# EasyEDA Pro project pcbsrc.eprj

# Schematic Schematic1

## Sheets
1 esp32: Board Name: Board1; Create Date: 2025-06-22; Page Name: P1; Project Name: pcbsrc; Schematic Name: Schematic1; Update Date: 2025-06-22; Company: 嘉立创EDA; Page Size: A4; Version: V1.0
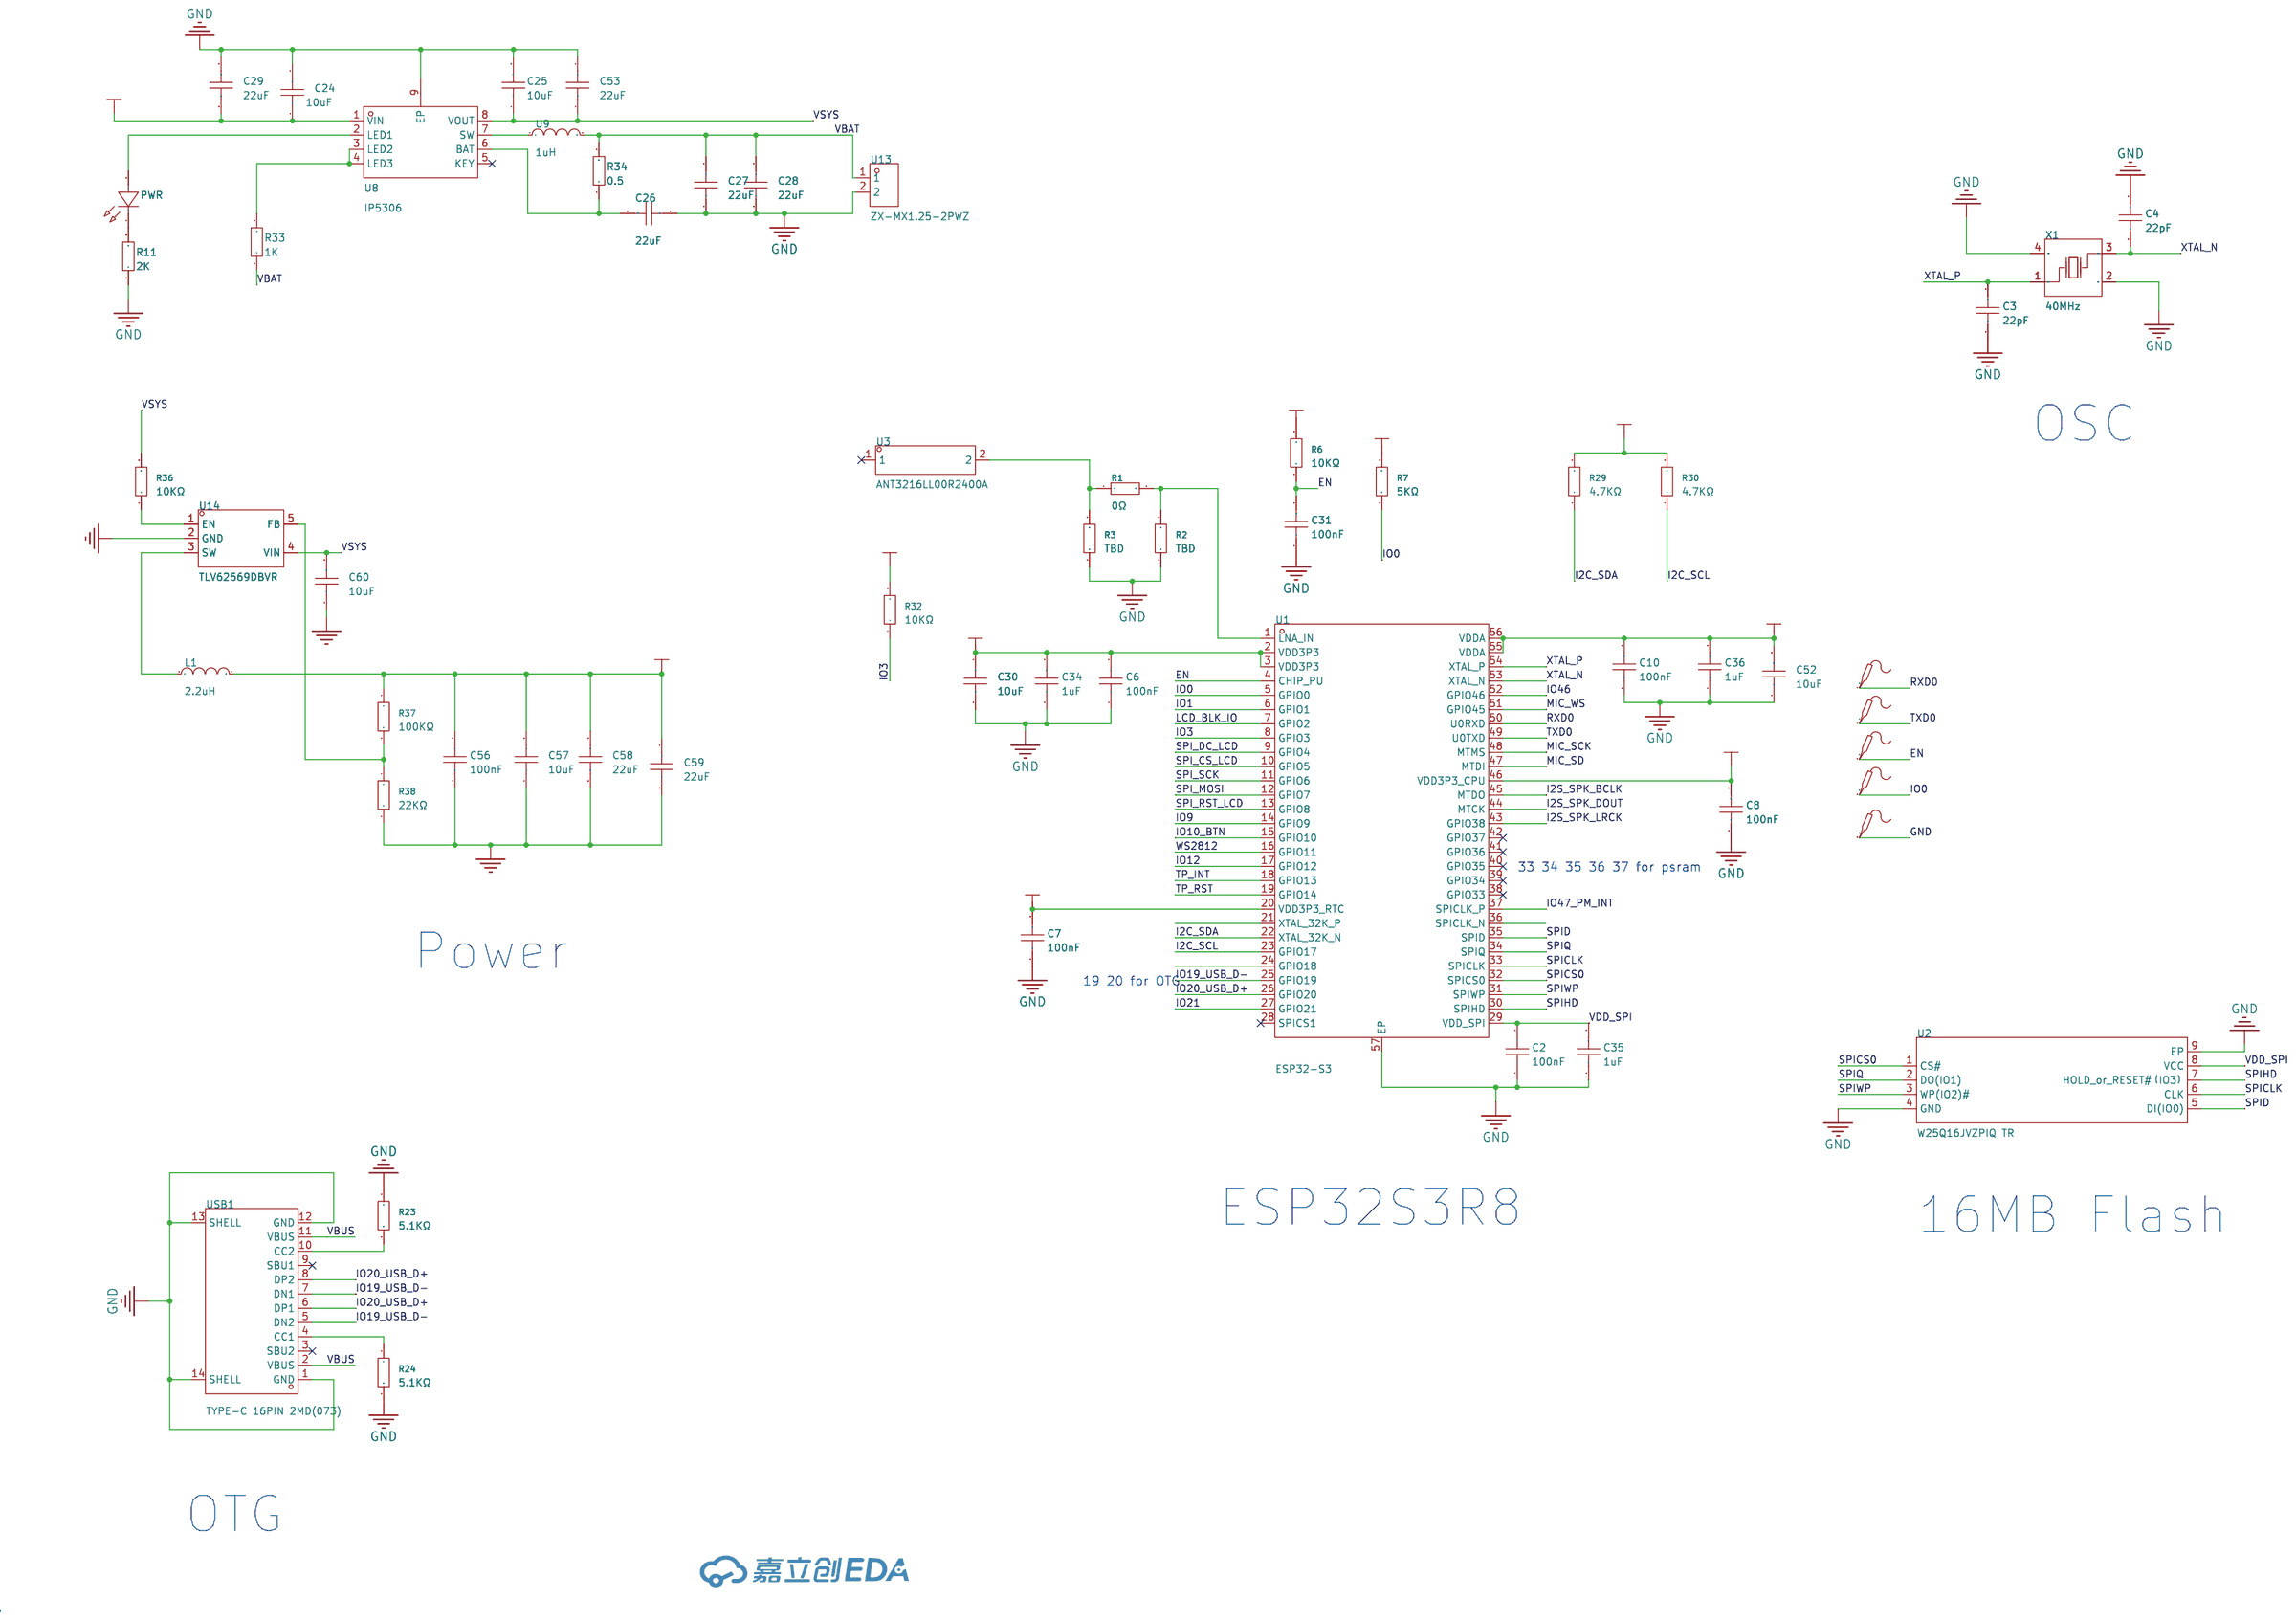
[diagram p0: esp32]
2 peripheral: Page Name: P2
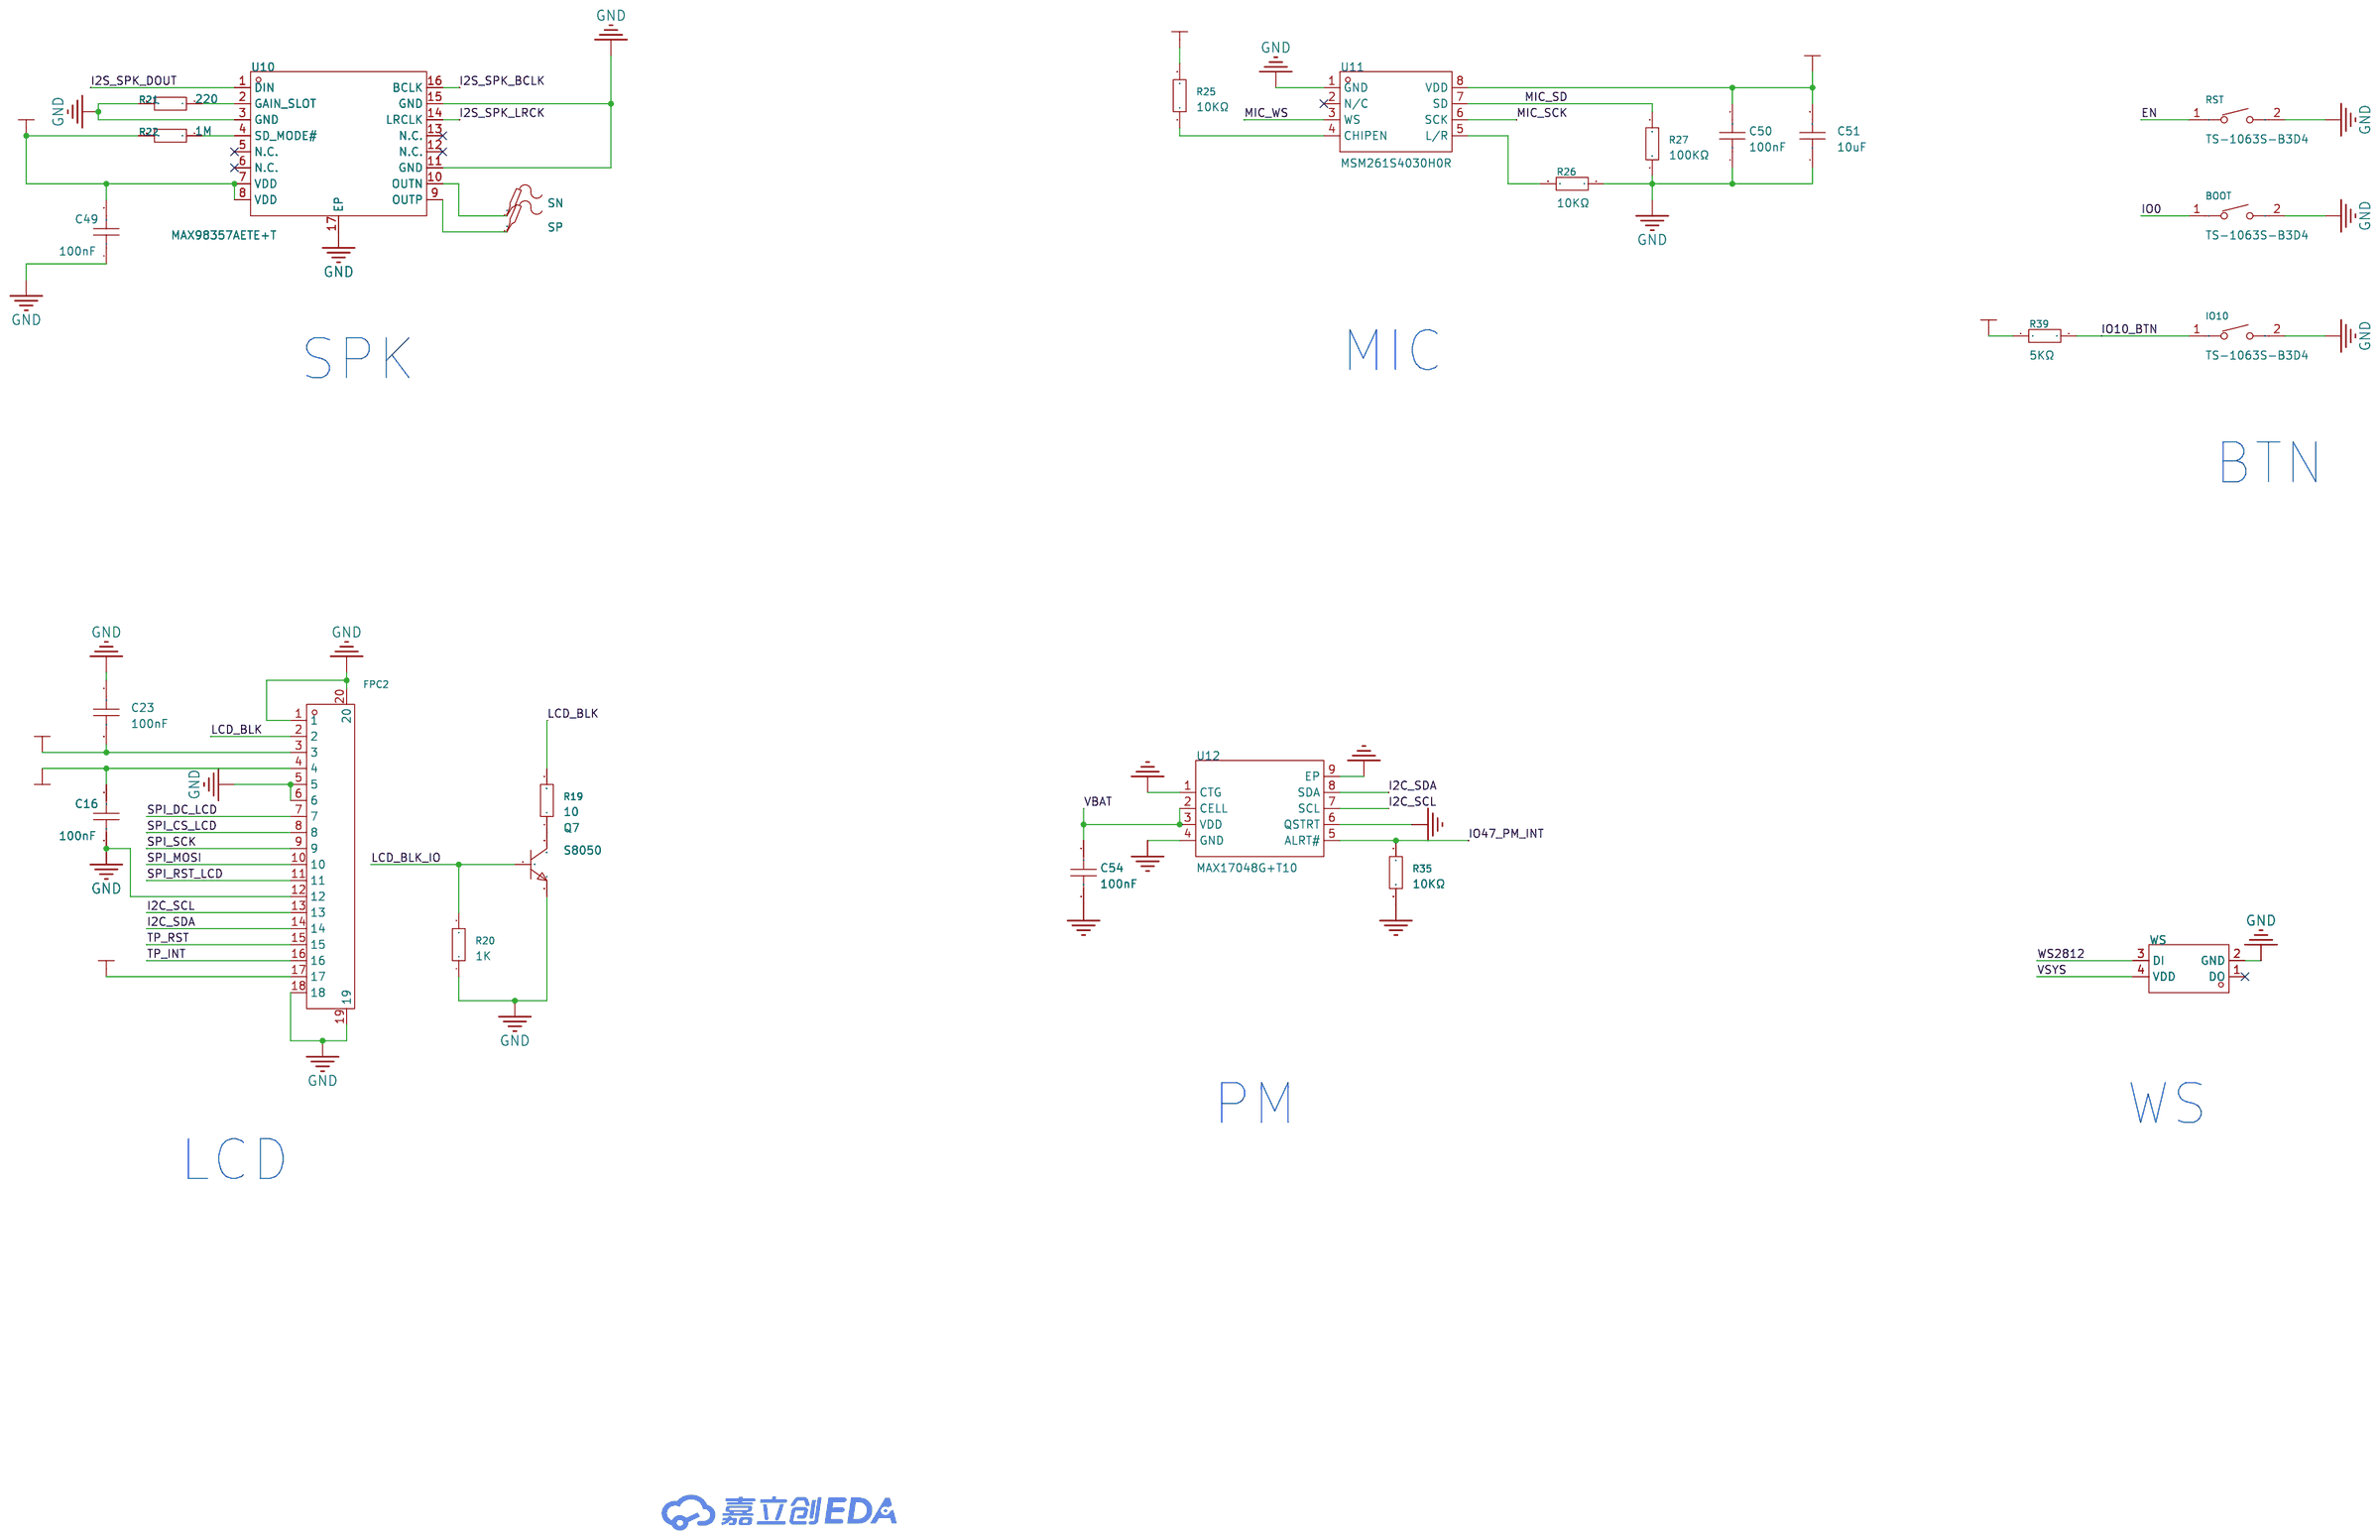
[diagram p1: peripheral]

## Parts
sheet esp32
C2  100nF  [C0402]
C3  22pF  [C0402]
C4  22pF  [C0402]
C6  100nF  [C0402]
C7  100nF  [C0402]
C8  100nF  [C0402]
C10  100nF  [C0402]
C24  10uF  [C0603]
C25  10uF  [C0603]
C26  22uF  [C0603]
C27  22uF  [C0603]
C28  22uF  [C0603]
C29  22uF  [C0603]
C30  10uF  [C0603]
C31  100nF  [C0402]
C34  1uF  [C0402]
C35  1uF  [C0402]
C36  1uF  [C0402]
C52  10uF  [C0603]
C53  22uF  [C0603]
C56  100nF  [C0402]
C57  10uF  [C0603]
C58  22uF  [C0603]
C59  22uF  [C0603]
C60  10uF  [C0603]
EN  -  [Test-Point-0.5mm]
IO0  -  [Test-Point-0.5mm]
IO11  -  [Test-Point-0.5mm]
L1  2.2uH  [IND-SMD_L4.0-W4.0_LQH44PN2R2MP0L]
PWR  XL-1608SURC-06  [LED0603-RD_RED]
R1  0Ω  [R0402]
R2  TBD  [R0402]
R3  TBD  [R0402]
R6  10KΩ  [R0402]
R7  5KΩ  [R0402]
R11  2K  [R0402]
R23  5.1KΩ  [R0402]
R24  5.1KΩ  [R0402]
R29  4.7KΩ  [R0402]
R30  4.7KΩ  [R0402]
R32  10KΩ  [R0402]
R33  1K  [R0402]
R34  1K  [R0402]
R36  10KΩ  [R0402]
R37  100KΩ  [R0402]
R38  22KΩ  [R0402]
RXD0  -  [Test-Point-0.5mm]
TXD0  -  [Test-Point-0.5mm]
U1  ESP32-S3  [QFN-56_L7.0-W7.0-P0.40-TL-EP4.0]
U2  W25Q16JVZPIQ TR  [WSON-8_L6.0-W5.0-P1.27-BL-EP]
U3  ANT3216LL00R2400A  [ANT-SMD_L3.2-W1.6]
U8  IP5306  [ESOP-8_L4.9-W3.9-P1.27-LS6.0-BL-EP]
U9  1uH  [IND-SMD_L2.5-W2.0_YXNAQ252010-3R3M]
U13  ZX-MX1.25-2PWZ  [CONN-TH_2P-P1.25_ZX-MX1.25-2PWZ]
U14  TLV62569DBVR  [SOT-23-5_L3.0-W1.7-P0.95-LS2.8-BR]
USB1  TYPE-C 16PIN 2MD(073)  [USB-C-SMD_TYPE-C-6PIN-2MD-073]
X1  40MHz  [OSC-SMD_4P-L3.2-W2.5-BL_SIT8008BI]
sheet peripheral
BOOT  TS-1063S-B3D4  [KEY-SMD_L3.0-W2.5-LS4.0_TS-1603S]
C16  100nF  [C0402]
C23  100nF  [C0402]
C49  100nF  [C0402]
C50  100nF  [C0402]
C51  10uF  [C0603]
C54  100nF  [C0402]
FPC2  FPC-05F-18PH20  [FPC-SMD_18P-P0.50_FPC-05F-18PH20]
IO10  TS-1063S-B3D4  [KEY-SMD_L3.0-W2.5-LS4.0_TS-1603S]
Q7  S8050  [SOT-23-3_L2.9-W1.3-P1.90-LS2.3-BR]
R19  10  [R0402]
R20  1K  [R0402]
R21  220  [R0402]
R22  1M  [R0402]
R25  10KΩ  [R0402]
R26  10KΩ  [R0402]
R27  100KΩ  [R0402]
R35  10KΩ  [R0402]
R39  5KΩ  [R0402]
RST  TS-1063S-B3D4  [KEY-SMD_L3.0-W2.5-LS4.0_TS-1603S]
SN  -  [Test-Point-0.5mm]
SP  -  [Test-Point-0.5mm]
U10  MAX98357AETE+T  [TQFN-16_L3.0-W3.0-P0.50-BL-EP1.5]
U11  MSM261S4030H0R  [MIC-SMD_8P-L4.0-W3.0-P1.00-BR]
U12  MAX17048G+T10  [TDFN-8_L2.0-W2.0-P0.50-BL-EP1.2]
WS  XL-2020RGBC-WS2812B  [LED-SMD_4P-L2.0-W2.0-BR-1]

## Library data of the parts
C2-C4 C6-C8 C10 C31 C34-C36 C50 C54 C56 = CL05A105KA5NQNC: Capacitance: Tolerance:±10% Tolerance:±10% Voltage Rated: Temperature Coefficient:; LCSC Part Name: 1uF ±10% 25V; Supplier Part: C52923; Manufacturer: SAMSUNG(三星); Supplier Footprint: 0402; JLCPCB Part Class: Basic Part; Datasheet: https://atta.szlcsc.com/upload/public/pdf/source/20160218/1457707763339.pdf; Supplier: LCSC; Tolerance: ±10%
C24-C29 C53 C58 C59 = CGA0603X5R106K100JT: 容值:10uF;精度:±10%;额定电压:10V;材质(温度系数):X5R;; LCSC Part Name: 10uF ±10% 10V; Supplier Part: C6119842; Manufacturer: HRE(芯声); Supplier Footprint: 0603; JLCPCB Part Class: 扩展库; Supplier: LCSC; Tolerance: ±10%; Voltage Rated: 10V; Temperature Coefficient: X5R
C30 C51 C52 C57 C60 = CGA0603X5R106K100JT: Capacitance:10uF Tolerance:±10% Tolerance:±10% Voltage Rating:10V Temperature Coefficient:X5R; LCSC Part Name: 10uF ±10% 10V; Supplier Part: C6119842; Manufacturer: HRE(芯声); Supplier Footprint: 0603; JLCPCB Part Class: Extended Part; Supplier: LCSC; Tolerance: ±10%; Voltage Rating: 10V; Temperature Coefficient: X5R
EN IO0 IO11 RXD0 TXD0 = Test-Point
L1 = SMNR4020-2.2UH: LCSC Part Name: 2.2uH ±20% 3.4A; Supplier Part: C135262; Manufacturer: SXN(顺翔诺); Supplier Footprint: SMD,4x4x2mm; Datasheet: https://atta.szlcsc.com/upload/public/pdf/source/20210812/995F2AD58C1C491532425584E325E086.pdf; Supplier: LCSC; Tolerance: ±20%; Rated Current: 3.4A; Saturation Current (Isat): 3.4A; DC Resistance (DCR): 46mΩ
PWR = XL-1608SURC-06: 发光颜色:红色;功率:55mW;正向电流:25mA;主波长:617nm~621nm;透镜颜色:无色透明透镜;色温:-;发光角度:120°;载带方式:正贴;工作温度:-30℃~+85℃;; Supplier Part: C965799; Manufacturer: XINGLIGHT(成兴光); Supplier Footprint: 0603; JLCPCB Part Class: 扩展库; Datasheet: https://atta.szlcsc.com/upload/public/pdf/source/20221102/D860AFDD1CDB02C5A8064103A32707E2.pdf; Supplier: LCSC; Emitted Color: 红色; Power Dissipation: 55mW; Forward Current: 25mA; Dominant Wavelength: 617nm~621nm; Peak Wavelength: 623nm; Lens Color: 无色透明透镜; Viewing Angle: 120°; Mounting Sytle: 正贴; Operating Temperature: -30℃~+85℃
R1-R3 R6 R7 R23-R27 R29 R30 R32 R35-R39 = 0402WGF0000TCE: Type:Thick Film Resistors Resistance: Tolerance:±1% Tolerance:±1% Power(Watts): Overload Voltage (Max): Temperature Coefficient:±800ppm/℃ Temperature Coefficient:±800ppm/℃ Operating Temperature Range:-55℃~+155℃ Operating Temperature Range:-55℃~+155℃; LCSC Part Name: 0Ω ±1% 62.5mW 厚膜电阻; Supplier Part: C17168; Manufacturer: UNI-ROYAL(厚声); Supplier Footprint: 0402; JLCPCB Part Class: Basic Part; Datasheet: https://atta.szlcsc.com/upload/public/pdf/source/20200306/C422600_1E6D84923E4A46A82E41ADD87F860B5C.pdf; Supplier: LCSC; Type: Thick Film Resistors; Tolerance: ±1%; Temperature Coefficient: ±800ppm/℃; Operating Temperature Range: -55℃~+155℃
R11 R33 R34 = 0402WGF4700TCE: 电阻类型:厚膜电阻;阻值:470Ω;精度:±1%;功率:62.5mW;最大工作电压:50V;温度系数:±100ppm/℃;; LCSC Part Name: 470Ω ±1% 62.5mW 厚膜电阻; Supplier Part: C25117; Manufacturer: UNI-ROYAL(厚声); Supplier Footprint: 0402; JLCPCB Part Class: 基础库; Datasheet: https://atta.szlcsc.com/upload/public/pdf/source/20200306/C422600_1E6D84923E4A46A82E41ADD87F860B5C.pdf; Supplier: LCSC; Type: 厚膜电阻; Tolerance: ±1%; Power(Watts): 62.5mW; Overload Voltage (Max): 50V; Temperature Coefficient: ±100ppm/℃; Operating Temperature Range: -55℃~+155℃
U1 = ESP32-S3: Frequency Range:2412MHz~2484MHz Frequency Range:2412MHz~2484MHz Interface:ADC,GPIO,I2C,I2S,PWM,SPI,UART,USB Operating Voltage:3V~3.6V Operating Voltage:3V~3.6V Applications:WiFi；IoT Output Power:21dBm Data Rate:150Mbps Current Of Transmitting:340mA Sensit; LCSC Part Name: 支持2.4GHz WIFI和低功耗蓝牙的MCU SoC; Supplier Part: C2913192; Manufacturer: ESPRESSIF(乐鑫); Supplier Footprint: QFN-56-EP(7x7); JLCPCB Part Class: Extended Part; Datasheet: https://atta.szlcsc.com/upload/public/pdf/source/20241030/3428D9BCA56E860957850BFAF37EAC62.pdf; Supplier: LCSC; Frequency Range: 2412MHz~2484MHz; Interface: ADC,GPIO,I2C,I2S,PWM,SPI,UART,USB; Operating Voltage: 3V~3.6V; Applications: WiFi；IoT; Output Power: 21dBm; Data Rate: 150Mbps; Current Of Transmitting: 340mA; Sensitivity: -98.4dBm; Receive Current: 88mA; Typical Application Frequency: 2.4GHz; Operating Temperature: -40℃~+105℃
U2 = W25Q16JVZPIQ TR: Supplier Part: C2456208; Manufacturer: WINBOND(华邦); Supplier Footprint: WSON-8-EP(5x6); JLCPCB Part Class: Extended Part; Datasheet: https://atta.szlcsc.com/upload/public/pdf/source/20190529/C115407_78E5B4F96E7138D299EC51EC5982A1A5.pdf; Supplier: LCSC
U3 = ANT3216LL00R2400A: Antenna Type:Chip Antenna Central Frequency:2450MHz Bandwidth:160MHz Peak Gain:5.05dBi Peak Gain:5.05dBi Polarization Type:Linear Impedance:50Ω Power capacity:1W VSWR:- Operating Temperature:-40℃~+105℃ Operating Temperature:-40℃~+105℃; LCSC Part Name: 无线组件陶瓷芯片天线; Supplier Part: C293767; Manufacturer: YAGEO(国巨); Supplier Footprint: 1206; JLCPCB Part Class: Extended Part; Datasheet: https://atta.szlcsc.com/upload/public/pdf/source/20181012/C293767_CDE82A2F74DC82A94DB708CB53B68F23.pdf; Supplier: LCSC; Antenna Type: Chip Antenna; Central Frequency: 2450MHz; Bandwidth: 160MHz; Peak Gain: 5.05dBi; Polarization Type: Linear; Impedance: 50Ω; Power capacity: 1W; Operating Temperature: -40℃~+105℃
U8 = IP5306: Supplier Part: C181692; Manufacturer: INJOINIC(英集芯); Supplier Footprint: ESOP-8; JLCPCB Part Class: Extended Part; Datasheet: https://atta.szlcsc.com/upload/public/pdf/source/20190627/C384572_9925B3DDC4041BC6108E5AB46A2A0AB1.pdf; Supplier: LCSC
U9 = IND\L2.5XW: Supplier Part: C9900016568; Supplier Footprint: 2.2uH/60; JLCPCB Part Class: Extended Part; Supplier: LCSC
U13 = ZX-MX1.25-2PWZ: Pins Structure:1x2P Pitch:1.25mm Mounting Style:Bend-in Reference Series:PicoBlade(MX 1.25) Number of Pins:2P Number of Rows:1 Number of PINs Per Row:2 Row Spacing:- Current Rating (Max):- Contact Material:Brass Contact Plating:Tin Operating Temperature R; LCSC Part Name: 1x2P 间距:1.25mm 弯插 系列:PicoBlade(MX 1.25) 配套胶壳型号：ZX-MX1.25-2PJK 配套端子型号：ZX-MX1.25-DZ 配套杜邦线型号：ZX-MX1.25-2PBXC; Supplier Part: C7430463; Manufacturer: Megastar(兆星); Supplier Footprint: 弯插,P=1.25mm; JLCPCB Part Class: Extended Part; Datasheet: https://atta.szlcsc.com/upload/public/pdf/source/20230619/EFC7482EB916E36F9EF0B03A9637C24F.pdf; Supplier: LCSC; Pins Structure: 1x2P; Pitch: 1.25mm; Mounting Style: Bend-in; Reference Series: PicoBlade(MX 1.25); Number of Pins: 2P; Number of Rows: 1; Number of PINs Per Row: 2; Contact Material: Brass; Contact Plating: Tin; Colour: White; Z-Height of the Board: 3.3mm; X-Length of Bottom Edge on Board (Spacing Line): 4.4mm; Y-Width of Bottom Edge on Board: 4.6mm
U14 = TLV62569DBVR: LCSC Part Name: 高效率同步降压转换器; Supplier Part: C141836; Manufacturer: TI(德州仪器); Supplier Footprint: SOT-23-5; Datasheet: https://www.ti.com/cn/lit/gpn/tlv62569; Supplier: LCSC; Function: 降压型; Output Type: 可调; Voltage - Supply: 2.5V~5.5V; Output Voltage: 600mV~5.5V; Output Current: 2A; Frequency - Switching: 1.5MHz; Operating Temperature: -40℃~+125℃@(TJ); Synchronous Rectifier: 是; Number of Outputs: 1; Topology: 降压式; Switch tube (built-in/external): 内置
USB1 = TYPE-C 16PIN 2MD(073): Connector Type:Type-C Standard:USB 3.1 Gender:Female Mounting Style:Horizontal attachment Number of Contacts:16P Number of Ports:1 Current Rating - Power (Max):5A Operating Temperature Range:-25℃~+85℃ Operating Temperature Range:-25℃~+85℃ Rated Voltage (M; LCSC Part Name: Type-C 母 卧贴; Supplier Part: C2765186; Manufacturer: SHOU HAN(首韩); Supplier Footprint: SMD; JLCPCB Part Class: Extended Part; Datasheet: https://atta.szlcsc.com/upload/public/pdf/source/20211123/39B17C16241EAC15C5E277BDA434118E.pdf; Supplier: LCSC; Connector Type: Type-C; Standard: USB 3.1; Gender: Female; Mounting Style: Horizontal attachment; Number of Contacts: 16P; Number of Ports: 1; Current Rating - Power (Max): 5A; Operating Temperature Range: -25℃~+85℃; Rated Voltage (Max): 5V; Connect-Disconnect Life: 5000 Cuts; Core Colour: Black
X1 = X322540MPB4SI: Crystal Type:Surface Mount Crystal Frequency: Normal temperature Frequency Tolerance:±10ppm Normal temperature Frequency Tolerance:±10ppm External load capacitor: Frequency Stability(Full temperature range):±20ppm Frequency Stability(Full temperature rang; LCSC Part Name: 40MHz ±10ppm 15pF; Supplier Part: C9010; Manufacturer: YXC(扬兴晶振); Supplier Footprint: SMD3225-4P; JLCPCB Part Class: Extended Part; Datasheet: https://atta.szlcsc.com/upload/public/pdf/source/20240329/19D5F850207469550BEB00D7DFEDBC7A.pdf; Supplier: LCSC; Crystal Type: Surface Mount Crystal; Normal temperature Frequency Tolerance: ±10ppm; Frequency Stability(Full temperature range): ±20ppm
BOOT IO10 RST = TS-1063S-B3D4: Circuit:SPST Actuator Style:Rectangle button Operating Force:250gf Mounting Style:- With Lamp:- Mechanical Life:-; LCSC Part Name: 轻触开关3.0*2.5侧按贴片带柱小小龟250gf; Supplier Part: C498291; Manufacturer: Yuandi(元迪); JLCPCB Part Class: Extended Part; Datasheet: https://atta.szlcsc.com/upload/public/pdf/source/20200318/C498291_A3607BD92317BA61A63F6AFAF35A0DD0.pdf; Supplier: LCSC; Circuit: SPST; Actuator Style: Rectangle button; Operating Force: 250gf
C16 C23 C49 = CL05B104KO5NNNC: Capacitance: Tolerance:±10% Tolerance:±10% Voltage Rated: Temperature Coefficient:; LCSC Part Name: 100nF ±10% 16V; Supplier Part: C1525; Manufacturer: SAMSUNG(三星); Supplier Footprint: 0402; JLCPCB Part Class: Basic Part; Datasheet: https://atta.szlcsc.com/upload/public/pdf/source/20160218/1457707763339.pdf; Supplier: LCSC; Tolerance: ±10%
FPC2 = FPC-05F-18PH20: Locking Feature:Clamshell Contact Type:Bottom Contact Number of Contacts:18P Pitch:0.5mm Mounting Type:卧贴 FFC, FCB Thickness:0.3mm FFC, FCB Thickness:0.3mm Height Above Board:2mm Operating Temperature Range:-25℃~+85℃ Operating Temperature Range:-25℃~+85℃; LCSC Part Name: 间距:0.5mm P数:18P 翻盖式 下接; Supplier Part: C2856802; Manufacturer: XUNPU(讯普); Supplier Footprint: SMD,P=0.5mm,卧贴; JLCPCB Part Class: Extended Part; Datasheet: https://atta.szlcsc.com/upload/public/pdf/source/20210922/C2856802_2A845D1961F33AEC1ED22CECB292335F.pdf; Supplier: LCSC; Locking Feature: Clamshell; Contact Type: Bottom Contact; Number of Contacts: 18P; Pitch: 0.5mm; Mounting Type: 卧贴; FFC, FCB Thickness: 0.3mm; Height Above Board: 2mm; Operating Temperature Range: -25℃~+85℃
Q7 = S8050_C20069125: type:NPN Current - Collector(Ic): Collector - Emitter Voltage VCEO: Pd - Power Dissipation:300mW DC Current Gain:120@50mA,1.0V DC Current Gain:120@50mA,1.0V Transition frequency(fT):100MHz Current - Collector Cutoff:100nA Vce Saturation(VCE(sat)):600mV Op; LCSC Part Name: hFE:200-350，丝印:J3Y S8050; Supplier Part: C20069125; Manufacturer: 宏嘉诚; Supplier Footprint: SOT-23; JLCPCB Part Class: Extended Part; Datasheet: https://atta.szlcsc.com/upload/public/pdf/source/20250107/343E8B94B5C24D0D65D7D4B70E0B73F6.pdf; Supplier: LCSC; type: NPN; Pd - Power Dissipation: 300mW; DC Current Gain: 120@50mA,1.0V; Transition frequency(fT): 100MHz; Current - Collector Cutoff: 100nA; Vce Saturation(VCE(sat)): 600mV; Operating Temperature: -55℃~+150℃
R19-R22 = 0402WGF4700TCE: Type:Thick Film Resistors Resistance: Tolerance:±1% Tolerance:±1% Power(Watts): Overload Voltage (Max): Temperature Coefficient:±100ppm/℃ Temperature Coefficient:±100ppm/℃ Operating Temperature Range:-55℃~+155℃ Operating Temperature Range:-55℃~+155℃; LCSC Part Name: 470Ω ±1% 62.5mW 厚膜电阻; Supplier Part: C25117; Manufacturer: UNI-ROYAL(厚声); Supplier Footprint: 0402; JLCPCB Part Class: Basic Part; Datasheet: https://atta.szlcsc.com/upload/public/pdf/source/20200306/C422600_1E6D84923E4A46A82E41ADD87F860B5C.pdf; Supplier: LCSC; Type: Thick Film Resistors; Tolerance: ±1%; Temperature Coefficient: ±100ppm/℃; Operating Temperature Range: -55℃~+155℃
SN SP = Test-Point: Test Point 测试点
U10 = MAX98357AETE+T: Type of Power Amplifier: Speaker Channels:Monaural Output Power: Supply Voltage:2.5V~5.5V Supply Voltage:2.5V~5.5V Operating Temperature:-40℃~+85℃ Operating Temperature:-40℃~+85℃; LCSC Part Name: 微型、低成本、PCM 类 D 级放大器具有 AB 级性能; Supplier Part: C910544; Manufacturer: ADI(亚德诺)/MAXIM(美信); Supplier Footprint: TQFN-16-EP(3x3); JLCPCB Part Class: Extended Part; Datasheet: https://atta.szlcsc.com/upload/public/pdf/source/20210106/C910544_CB6DE4B2CEE254A72E6BDB40E718D281.pdf; Supplier: LCSC; Speaker Channels: Monaural; Supply Voltage: 2.5V~5.5V; Operating Temperature: -40℃~+85℃
U11 = MSM261S4030H0R: Supplier Part: C2840615; Manufacturer: MEMS(敏芯微); JLCPCB Part Class: Extended Part; Datasheet: https://atta.szlcsc.com/upload/public/pdf/source/20210707/C2840615_6AE5BCBEE3224C96A8195D5DC270E7C8.pdf; Supplier: LCSC
U12 = MAX17048G+T10: LCSC Part Name: 单节/双节电池电量计使用ModelGauge技术; Supplier Part: C2682616; Manufacturer: ADI(亚德诺)/MAXIM(美信); Supplier Footprint: DFN-8-EP(2x2); Datasheet: https://atta.szlcsc.com/upload/public/pdf/source/20210106/C2682616_818568B5D3BA4B627110FCAA33E0BFB1.pdf; Supplier: LCSC; The Chip Type: 电池监测芯片; Voltage - Supply: 2.5V~4.5V; Type of Battery: 锂离子/聚合物; Number of Cells: 1; Operating Temperature: -40℃~+85℃
WS = XL-2020RGBC-WS2812B: Wavelength:620nm~625nm；470nm~475nm；525nm~530nm Luminous Intensity:150mcd；150mcd；400mcd Lens Color:Translucent Fog Lens Installation method:Positive Stick Operating Temperature:-20℃~+85℃; LCSC Part Name: 幻彩透明; Supplier Part: C5349955; Manufacturer: XINGLIGHT(成兴光); Supplier Footprint: 2020; JLCPCB Part Class: Extended Part; Datasheet: https://atta.szlcsc.com/upload/public/pdf/source/20230111/97A2D5930F183799801175706AF118AF.pdf; Supplier: LCSC; Wavelength: 620nm~625nm；470nm~475nm；525nm~530nm; Luminous Intensity: 150mcd；150mcd；400mcd; Lens Color: Translucent Fog Lens; Installation method: Positive Stick; Operating Temperature: -20℃~+85℃

## Nets
GND: BOOT.2 C2.1 C3.1 C4.2 C6.1 C7.1 C8.1 C10.1 C16.1 C23.1 C24.2 C25.2 C26.1 C27.2 C28.2 C29.1 C30.1 C31.1 C34.1 C35.1 C36.1 C49.1 C50.1 C51.1 C52.1 C53.1 C54.1 C56.1 C57.1 C58.2 C59.2 C60.1 FPC2.1 FPC2.5 FPC2.6 FPC2.12 FPC2.18 FPC2.19 FPC2.20 IO10.2 IO11.1 Q7.2(E) R2.1 R3.1 R11.1 R20.1 R21.2 R23.1 R24.2 R26.1 R27.2 R35.2 R38.2 RST.2 U1.57(EP) U2.4(GND) U2.9(EP) U8.9(EP) U10.3(GND) U10.11(GND) U10.15(GND) U10.17(EP) U11.1(GND) U12.1(CTG) U12.4(GND) U12.6(QSTRT) U12.9(EP) U13.2 U14.2(GND) USB1.1(GND) USB1.12(GND) USB1.13(SHELL) USB1.14(SHELL) WS.2(GND) X1.2(GND) X1.4(GND)
VBAT: C27.1 C28.1 C54.2 R33.1 R34.2 U9.2 U12.2(CELL) U12.3(VDD) U13.1
VBUS: C24.1 C29.2 U8.1(VIN) USB1.2(VBUS) USB1.11(VBUS)
VDD33: C6.2 C7.2 C8.2 C10.2 C16.2 C23.2 C30.2 C34.2 C36.2 C49.2 C50.2 C51.2 C52.2 C56.2 C57.2 C58.1 C59.1 FPC2.3 FPC2.4 FPC2.17 L1.2 R6.2 R7.2 R22.2 R25.2 R29.2 R30.2 R32.2 R37.1 R39.2 U1.2(VDD3P3) U1.3(VDD3P3) U1.20(VDD3P3_RTC) U1.46(VDD3P3_CPU) U1.55(VDDA) U1.56(VDDA) U10.7(VDD) U10.8(VDD) U11.8(VDD)
VDD_SPI: C2.2 C35.2 U1.29(VDD_SPI) U2.8(VCC)
EN: C31.2 EN.1 R6.1 RST.1 U1.4(CHIP_PU)
I2C_SCL: FPC2.13 R30.1 U1.23(GPIO17) U12.7(SCL)
I2C_SDA: FPC2.14 R29.1 U1.22(XTAL_32K_N) U12.8(SDA)
I2S_SPK_BCLK: U1.45(MTDO) U10.16(BCLK)
I2S_SPK_DOUT: U1.44(MTCK) U10.1(DIN)
I2S_SPK_LRCK: U1.43(GPIO38) U10.14(LRCLK)
IO0: BOOT.1 IO0.1 R7.1 U1.5(GPIO0)
IO1: U1.6(GPIO1)
IO3: R32.1 U1.8(GPIO3)
IO9: U1.14(GPIO9)
IO10_BTN: IO10.1 R39.1 U1.15(GPIO10)
IO12: U1.17(GPIO12)
IO19_USB_D-: U1.25(GPIO19) USB1.5(DN2) USB1.7(DN1)
IO20_USB_D+: U1.26(GPIO20) USB1.6(DP1) USB1.8(DP2)
IO21: U1.27(GPIO21)
IO46: U1.52(GPIO46)
IO47_PM_INT: R35.1 U1.37(SPICLK_P) U12.5(ALRT#)
LCD_BLK: FPC2.2 R19.2
LCD_BLK_IO: Q7.1(B) R20.2 U1.7(GPIO2)
MIC_SCK: U1.48(MTMS) U11.6(SCK)
MIC_SD: R27.1 U1.47(MTDI) U11.7(SD)
MIC_WS: U1.51(GPIO45) U11.3(WS)
RXD0: RXD0.1 U1.50(U0RXD)
SPI_CS_LCD: FPC2.8 U1.10(GPIO5)
SPI_DC_LCD: FPC2.7 U1.9(GPIO4)
SPI_MOSI: FPC2.10 U1.12(GPIO7)
SPI_RST_LCD: FPC2.11 U1.13(GPIO8)
SPI_SCK: FPC2.9 U1.11(GPIO6)
SPICLK: U1.33(SPICLK) U2.6(CLK)
SPICS0: U1.32(SPICS0) U2.1(CS#)
SPID: U1.35(SPID) U2.5(DI(IO0))
SPIHD: U1.30(SPIHD) U2.7(HOLD or RESET#（IO3）)
SPIQ: U1.34(SPIQ) U2.2(DO(IO1))
SPIWP: U1.31(SPIWP) U2.3(WP(IO2)#)
TP_INT: FPC2.16 U1.18(GPIO13)
TP_RST: FPC2.15 U1.19(GPIO14)
TXD0: TXD0.1 U1.49(U0TXD)
VSYS: C25.1 C53.2 C60.2 R36.2 U8.8(VOUT) U14.4(VIN) WS.4(VDD)
WS2812: U1.16(GPIO11) WS.3(DI)
XTAL_N: C4.1 U1.53(XTAL_N) X1.3(OSC2)
XTAL_P: C3.2 U1.54(XTAL_P) X1.1(OSC1)
$1N2478: R1.2 R2.2 U1.1(LNA_IN)
$1N2479: R1.1 R3.2 U3.2
$1N2649: R24.1 USB1.4(CC1)
$1N2650: R23.2 USB1.10(CC2)
$1N4983: PWR.2(A) U8.2(LED1)
$1N4984: PWR.1(K) R11.2
$1N4986: R33.2 U8.3(LED2) U8.4(LED3)
$1N4992: U8.7(SW) U9.1
$1N4995: C26.2 R34.1 U8.6(BAT)
$1N6386: R36.1 U14.1(EN)
$1N6489: L1.1 U14.3(SW)
$1N8678: R37.2 R38.1 U14.5(FB)
$2N1480: Q7.3(C) R19.1
$2N1482: SP.1 U10.9(OUTP)
$2N1483: SN.1 U10.10(OUTN)
$2N1487: R22.1 U10.4(SD_MODE#)
$2N1489: R21.1 U10.2(GAIN_SLOT)
$2N1510: R25.1 U11.4(CHIPEN)
$2N1512: R26.2 U11.5(L/R)

Not connected (* = marked no-connect by the designer): U1 21(XTAL_32K_P) 24(GPIO18) 28(SPICS1)* 36(SPICLK_N) 38(GPIO33)* 39(GPIO34)* 40(GPIO35)* 41(GPIO36)* 42(GPIO37)*; U3 1*; U8 5(KEY)*; U10 5(N.C.)* 6(N.C.)* 12(N.C.)* 13(N.C.)*; U11 2(N/C)*; USB1 3(SBU2)* 9(SBU1)*; WS 1(DO)*

## Notes on the sheets
sheet 1
- OSC
- 33 34 35 36 37 for psram
- Power
- 19 20 for OTG
- ESP32S3R8
- 16MB Flash
- OTG
sheet 2
- SPK
- MIC
- BTN
- PM
- WS
- LCD

# Board PCB1
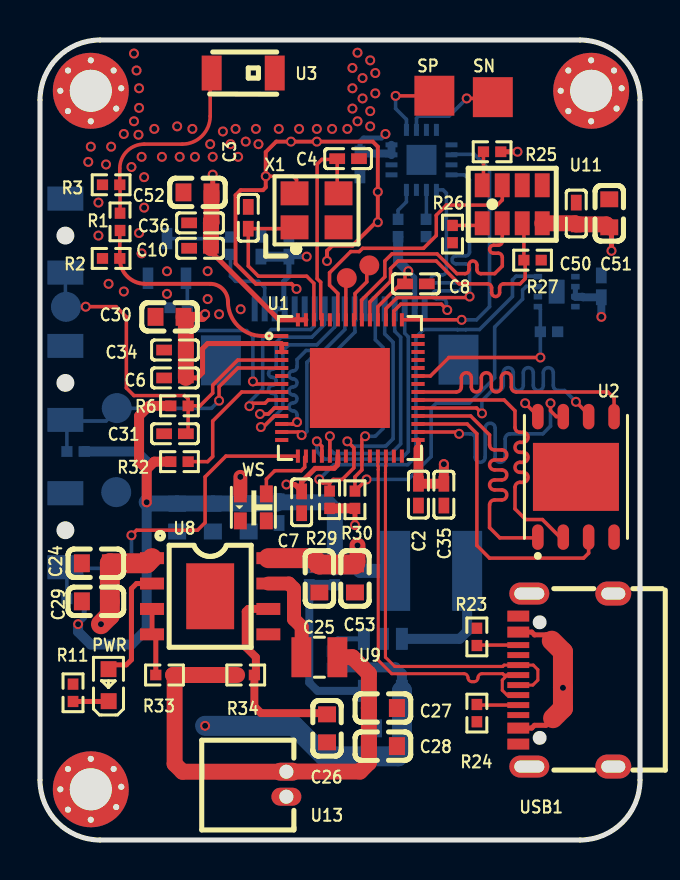
[diagram p2: board, top side]
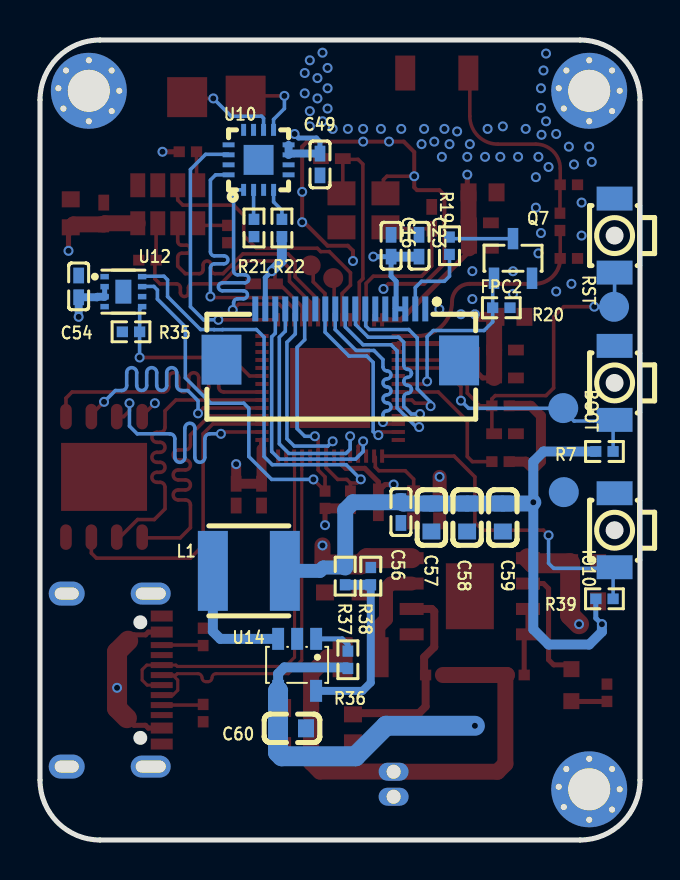
[diagram p3: board, bottom side, seen from below]

Outline 30 x 40 mm; copper layers: Top Layer, GND, PWR, Bottom Layer. Coordinates in mm from the lower left corner of the outline.
Outline path: 0,37 0,3 arc(0.88,0.88) 3,0 27,0 arc(29.12,0.88) 30,3 30,37 arc(29.12,39.12) 27,40 3,40 arc(0.88,39.12) 0,37
Stack: Top Layer 0.035mm 外层铜厚1oz / Dielectric1 0.2104mm 7628 RC49% 8.6mil / GND 0.0152mm 内层铜厚 / Dielectric2 1.065mm 1.1mm H/HOZ Copper / PWR 0.0152mm 内层铜厚 / Dielectric3 0.2104mm 7628 RC49% 8.6mil / Bottom Layer 0.035mm 外层铜厚1oz

## Design rules (mm)
net IO19_USB_D-: DP1
net IO20_USB_D+: DP1
template: 自定义配置
spacing copperThickness1oz (default): track to track 0.102, other pairs 0.152 to 0.3
spacing copperThickness2oz: track to track 0.203, other pairs 0.152 to 0.3
track width copperThickness1oz (default): min 0.127, default 0.254, max 2.54
track width copperThickness2oz: min 0.203, default 0.254, max 2.54
differential pair differentialPair (default): width min 0.158, default 0.158, max 0.158; gap min 0.203, default 0.203
via viaSize (default): diameter min 0.5, default 0.5, max 10; hole min 0.3, default 0.3, max 6.3

## Placement (name value [footprint] x y rotation side)
BOOT  TS-1063S-B3D4  [KEY-SMD_L3.0-W2.5-LS4.0_TS-1603S]  1.27 22.86 90 bottom
C2  100nF  [C0402]  18.92 17.27 90 top
C3  22pF  [C0402]  10.41 31.11 270 top
C4  22pF  [C0402]  15.4 34.07 0 top
C6  100nF  [C0402]  6.75 23.1 0 top
C7  100nF  [C0402]  13.08 16.89 90 top
C8  100nF  [C0402]  18.8 27.81 180 top
C10  100nF  [C0402]  8 29.59 0 top
C16  100nF  [C0402]  12.45 29.71 270 bottom
C23  100nF  [C0402]  11.05 29.71 270 bottom
C24  10uF  [C0603]  2.79 13.84 180 top
C25  10uF  [C0603]  13.97 13.08 270 top
C26  22uF  [C0603]  14.35 5.58 90 top
C27  22uF  [C0603]  17.14 6.6 0 top
C28  22uF  [C0603]  17.14 4.69 0 top
C29  22uF  [C0603]  2.79 11.93 0 top
C30  10uF  [C0603]  6.48 26.16 0 top
C31  100nF  [C0402]  6.75 20.31 0 top
C34  1uF  [C0402]  6.75 24.5 0 top
C35  1uF  [C0402]  20.19 17.27 90 top
C36  1uF  [C0402]  8 30.86 0 top
C49  100nF  [C0402]  16 33.78 90 bottom
C50  100nF  [C0402]  26.81 31.33 270 top
C51  10uF  [C0603]  28.46 31.33 270 top
C52  10uF  [C0603]  7.87 32.38 0 top
C53  22uF  [C0603]  15.75 13.08 90 top
C54  100nF  [C0402]  28.07 27.68 270 bottom
C56  100nF  [C0402]  11.95 16.4 90 bottom
C57  10uF  [C0603]  10.43 16.12 90 bottom
C58  22uF  [C0603]  8.64 16.12 270 bottom
C59  22uF  [C0603]  6.86 16.12 270 bottom
C60  10uF  [C0603]  17.4 5.58 0 bottom
EN  -  [Test-Point-0.5mm]  1.3 26.66 0 top
FPC2  FPC-05F-18PH20  [FPC-SMD_18P-P0.50_FPC-05F-18PH20]  14.99 25.27 180 bottom
IO0  -  [Test-Point-0.5mm]  3.84 21.6 0 top
IO10  TS-1063S-B3D4  [KEY-SMD_L3.0-W2.5-LS4.0_TS-1603S]  1.27 15.49 90 bottom
IO11  -  [Test-Point-0.5mm]  3.81 17.39 0 top
L1  2.2uH  [IND-SMD_L4.0-W4.0_LQH44PN2R2MP0L]  19.56 13.46 180 bottom
NOREF  -  [Pad_e150]  2.54 2.54 180 top
NOREF#2  -  [Pad_e154]  4.06 2.66 180 top
NOREF#3  -  [Pad_e121]  2.54 38.98 180 top
NOREF#4  -  [Pad_e144]  28.83 36.57 180 top
NOREF#5  -  [Pad_e147]  28.7 38.48 180 top
NOREF#6  -  [Pad_e149]  27.56 35.94 180 top
NOREF#7  -  [Pad_e137]  3.81 36.57 180 top
NOREF#8  -  [Pad_e132]  1.02 37.46 180 top
NOREF#9  -  [Pad_e138]  3.68 38.48 180 top
NOREF#10  -  [Pad_e116]  2.54 37.46 180 top
NOREF#11  -  [Pad_e145]  29.08 37.59 180 top
NOREF#12  -  [Pad_e153]  3.81 1.65 180 top
NOREF#13  -  [Pad_e156]  3.68 3.55 180 top
NOREF#14  -  [Pad_e146]  26.42 38.48 180 top
NOREF#15  -  [Pad_e130]  1.4 38.48 180 top
NOREF#16  -  [Pad_e152]  1.4 1.52 180 top
NOREF#17  -  [Pad_e142]  26.03 37.46 180 top
NOREF#18  -  [Pad_e151]  1.02 2.54 180 top
NOREF#19  -  [Pad_e157]  2.54 4.06 180 top
NOREF#20  -  [Pad_e135]  2.54 35.94 180 top
NOREF#21  -  [Pad_e148]  27.56 38.98 180 top
NOREF#22  -  [Pad_e143]  26.42 36.44 180 top
NOREF#23  -  [Pad_e141]  27.56 37.46 180 top
NOREF#24  -  [Pad_e136]  1.4 36.44 180 top
NOREF#25  -  [Pad_e155]  1.4 3.55 180 top
NOREF#26  -  [Pad_e133]  4.06 37.59 180 top
NOREF#27  -  [Pad_e158]  2.54 1.01 180 top
PWR  XL-1608SURC-06  [LED0603-RD_RED]  3.43 7.74 90 top
Q7  S8050  [SOT-23-3_L2.9-W1.3-P1.90-LS2.3-BR]  6.35 29.08 270 bottom
R1  0Ω  [R0402]  4 30.91 270 top
R2  TBD  [R0402]  3.56 29.08 0 top
R3  TBD  [R0402]  3.56 32.76 0 top
R6  10KΩ  [R0402]  6.97 21.71 180 top
R7  5KΩ  [R0402]  1.78 19.43 0 bottom
R11  2K  [R0402]  1.65 7.36 270 top
R19  10  [R0402]  9.52 29.71 270 bottom
R20  1K  [R0402]  6.93 26.61 0 bottom
R21  220  [R0402]  19.3 30.6 270 bottom
R22  1M  [R0402]  17.9 30.6 270 bottom
R23  5.1KΩ  [R0402]  21.84 10.16 270 top
R24  5.1KΩ  [R0402]  21.84 6.35 270 top
R25  10KΩ  [R0402]  22.61 34.41 0 top
R26  10KΩ  [R0402]  20.63 30.3 90 top
R27  100KΩ  [R0402]  24.63 28.99 0 top
R29  4.7KΩ  [R0402]  14.48 17.01 270 top
R30  4.7KΩ  [R0402]  15.75 17.01 270 top
R32  10KΩ  [R0402]  6.97 18.92 180 top
R33  1K  [R0402]  6.22 8.25 180 top
R34  1K  [R0402]  10.29 8.25 180 top
R35  10KΩ  [R0402]  25.45 25.41 0 bottom
R36  10KΩ  [R0402]  14.6 9.01 270 bottom
R37  100KΩ  [R0402]  14.74 13.19 270 bottom
R38  22KΩ  [R0402]  13.46 13.19 90 bottom
R39  5KΩ  [R0402]  1.78 12.06 0 bottom
RST  TS-1063S-B3D4  [KEY-SMD_L3.0-W2.5-LS4.0_TS-1603S]  1.27 30.22 90 bottom
RXD0  -  [Test-Point-0.5mm#2]  15.34 28.1 90 top
SN  -  [Test-Point-0.5mm#3]  22.64 37.14 0 top
SP  -  [Test-Point-0.5mm#3]  19.72 37.22 0 top
TXD0  -  [Test-Point-0.5mm#2]  16.47 28.73 90 top
U1  ESP32-S3  [QFN-56_L7.0-W7.0-P0.40-TL-EP4.0]  15.49 22.6 0 top
U2  W25Q16JVZPIQ TR  [WSON-8_L6.0-W5.0-P1.27-BL-EP]  26.8 18.16 0 top
U3  ANT3216LL00R2400A  [ANT-SMD_L3.2-W1.6]  10.16 38.35 180 top
U8  IP5306  [ESOP-8_L4.9-W3.9-P1.27-LS6.0-BL-EP]  8.51 12.19 270 top
U9  1uH  [IND-SMD_L2.5-W2.0_YXNAQ252010-3R3M]  13.97 9.14 180 top
U10  MAX98357AETE+T  [TQFN-16_L3.0-W3.0-P0.50-BL-EP1.5]  19.07 34.01 180 bottom
U11  MSM261S4030H0R  [MIC-SMD_8P-L4.0-W3.0-P1.00-BR]  23.61 31.79 90 top
U12  MAX17048G+T10  [TDFN-8_L2.0-W2.0-P0.50-BL-EP1.2]  25.83 27.42 270 bottom
U13  ZX-MX1.25-2PWZ  [CONN-TH_2P-P1.25_ZX-MX1.25-2PWZ]  12.32 2.79 270 top
U14  TLV62569DBVR  [SOT-23-5_L3.0-W1.7-P0.95-LS2.8-BR]  17.14 8.76 90 bottom
USB1  TYPE-C 16PIN 2MD(073)  [USB-C-SMD_TYPE-C-6PIN-2MD-073]  26.29 8 90 top
WS  XL-2020RGBC-WS2812B  [LED-SMD_4P-L2.0-W2.0-BR-1]  10.67 16.63 270 top
X1  40MHz  [OSC-SMD_4P-L3.2-W2.5-BL_SIT8008BI]  13.83 31.48 0 top

## Footprints (pads in the part's own frame, mm; a bottom-side part is the same pattern mirrored in y, then rotated)
ANT-SMD_L3.2-W1.6
  rect 1x1.75 smd: 1(-1.578,0) 2(1.578,0)
C0402
  rect 0.79x0.54 smd: 1(-0.545,0) 2(0.545,0)
C0603
  rect 0.8x0.9 smd: 1(-0.7,0) 2(0.7,0)
CONN-TH_2P-P1.25_ZX-MX1.25-2PWZ
  oval 0.9x1.5 hole 0.7: 1(-0.625,0) 2(0.625,0)
ESOP-8_L4.9-W3.9-P1.27-LS6.0-BL-EP
  rect 0.6x1.2 smd: 1(-1.905,-2.909) 2(-0.635,-2.909) 3(0.635,-2.909) 4(1.905,-2.909) 5(1.905,2.909) 6(0.635,2.909) 7(-0.635,2.909) 8(-1.905,2.909)
  rect 3.3x2.4 smd: 9(0,0)
FPC-SMD_18P-P0.50_FPC-05F-18PH20
  rect 0.3x1.25 smd: 1(4.25,1.288) 2(3.75,1.288) 3(3.25,1.288) 4(2.75,1.288) 5(2.25,1.288) 6(1.75,1.288) 7(1.25,1.288) 8(0.75,1.288) 9(0.25,1.288) 10(-0.25,1.288) 11(-0.75,1.288) 12(-1.25,1.288) 13(-1.75,1.288) 14(-2.25,1.288) 15(-2.75,1.288) 16(-3.25,1.288) 17(-3.75,1.288) 18(-4.25,1.288)
  rect 2x2.5 smd: 19(5.94,-1.288) 20(-5.94,-1.252)
IND-SMD_L2.5-W2.0_YXNAQ252010-3R3M
  rect 1x2 smd: 1(0.9,0) 2(-0.9,0)
IND-SMD_L4.0-W4.0_LQH44PN2R2MP0L
  rect 1.5x4 smd: 1(-1.8,0) 2(1.8,0)
KEY-SMD_L3.0-W2.5-LS4.0_TS-1603S
  rect 1.2x1.8 smd: 1(-1.85,0) 2(1.85,0)
LED0603-RD_RED
  rect 0.8x0.8 smd: 1(-0.799,-0.004) 2(0.799,0.004)
LED-SMD_4P-L2.0-W2.0-BR-1
  rect 0.85x0.65 smd: 1(0.675,-0.65) 2(0.675,0.65) 3(-0.675,0.65) 4(-0.675,-0.65)
MIC-SMD_8P-L4.0-W3.0-P1.00-BR
  rect 1.2x0.75 smd: 1(0.95,-1.5) 2(0.95,-0.5) 3(0.95,0.5) 4(0.95,1.5) 5(-0.95,1.5) 6(-0.95,0.5) 7(-0.95,-0.5) 8(-0.95,-1.5)
OSC-SMD_4P-L3.2-W2.5-BL_SIT8008BI
  rect 1.4x1.2 smd: 1(-1.1,-0.85) 2(1.1,-0.85) 3(1.1,0.85) 4(-1.1,0.85)
Pad_e116
  round 3.8 hole 2.1: (0,0)
Pad_e121
  round 0.61 hole 0.305: (0,0)
Pad_e130
  round 0.61 hole 0.305: (0,0)
Pad_e132
  round 0.61 hole 0.305: (0,0)
Pad_e133
  round 0.61 hole 0.305: (0,0)
Pad_e135
  round 0.61 hole 0.305: (0,0)
Pad_e136
  round 0.61 hole 0.305: (0,0)
Pad_e137
  round 0.61 hole 0.305: (0,0)
Pad_e138
  round 0.61 hole 0.305: (0,0)
Pad_e141
  round 3.8 hole 2.1: (0,0)
Pad_e142
  round 0.61 hole 0.305: (0,0)
Pad_e143
  round 0.61 hole 0.305: (0,0)
Pad_e144
  round 0.61 hole 0.305: (0,0)
Pad_e145
  round 0.61 hole 0.305: (0,0)
Pad_e146
  round 0.61 hole 0.305: (0,0)
Pad_e147
  round 0.61 hole 0.305: (0,0)
Pad_e148
  round 0.61 hole 0.305: (0,0)
Pad_e149
  round 0.61 hole 0.305: (0,0)
Pad_e150
  round 3.8 hole 2.1: (0,0)
Pad_e151
  round 0.61 hole 0.305: (0,0)
Pad_e152
  round 0.61 hole 0.305: (0,0)
Pad_e153
  round 0.61 hole 0.305: (0,0)
Pad_e154
  round 0.61 hole 0.305: (0,0)
Pad_e155
  round 0.61 hole 0.305: (0,0)
Pad_e156
  round 0.61 hole 0.305: (0,0)
Pad_e157
  round 0.61 hole 0.305: (0,0)
Pad_e158
  round 0.61 hole 0.305: (0,0)
QFN-56_L7.0-W7.0-P0.40-TL-EP4.0
  rect 0.665x0.2 smd: 1(-3.408,2.6) 2(-3.408,2.2) 3(-3.408,1.8) 4(-3.408,1.4) 5(-3.408,1) 6(-3.408,0.6) 7(-3.408,0.2) 8(-3.408,-0.2) 9(-3.408,-0.6) 10(-3.408,-1) 11(-3.408,-1.4) 12(-3.408,-1.8) 13(-3.408,-2.2) 14(-3.408,-2.6) 29(3.408,-2.6) 30(3.408,-2.2) 31(3.408,-1.8) 32(3.408,-1.4) 33(3.408,-1) 34(3.408,-0.6) 35(3.408,-0.2) 36(3.408,0.2) 37(3.408,0.6) 38(3.408,1) 39(3.408,1.4) 40(3.408,1.8) 41(3.408,2.2) 42(3.408,2.6)
  rect 0.2x0.665 smd: 15(-2.6,-3.408) 16(-2.2,-3.408) 17(-1.8,-3.408) 18(-1.4,-3.408) 19(-1,-3.408) 20(-0.6,-3.408) 21(-0.2,-3.408) 22(0.2,-3.408) 23(0.6,-3.408) 24(1,-3.408) 25(1.4,-3.408) 26(1.8,-3.408) 27(2.2,-3.408) 28(2.6,-3.408) 43(2.6,3.408) 44(2.2,3.408) 45(1.8,3.408) 46(1.4,3.408) 47(1,3.408) 48(0.6,3.408) 49(0.2,3.408) 50(-0.2,3.408) 51(-0.6,3.408) 52(-1,3.408) 53(-1.4,3.408) 54(-1.8,3.408) 55(-2.2,3.408) 56(-2.6,3.408)
  rect 4x4 smd: 57(0,0)
R0402
  rect 0.566x0.54 smd: 1(-0.433,0) 2(0.433,0)
SOT-23-3_L2.9-W1.3-P1.90-LS2.3-BR
  rect 1.07x0.532 smd: 1(0.99,-0.95) 2(0.99,0.95) 3(-0.99,0)
SOT-23-5_L3.0-W1.7-P0.95-LS2.8-BR
  rect 1.1x0.6 smd: 1(1.3,-0.95) 2(1.3,0) 3(1.3,0.95) 4(-1.3,0.95) 5(-1.3,-0.95)
TDFN-8_L2.0-W2.0-P0.50-BL-EP1.2
  rect 0.28x0.425 smd: 1(-0.75,-0.938) 2(-0.25,-0.938) 3(0.25,-0.938) 4(0.75,-0.938) 5(0.75,0.938) 6(0.25,0.938) 7(-0.25,0.938) 8(-0.75,0.938)
  rect 1.2x0.8 smd: 9(0,0)
Test-Point-0.5mm
  round 1.5 smd far side: 1(0,0)
Test-Point-0.5mm#2
  round 1 smd: 1(0,0)
Test-Point-0.5mm#3
  rect 2x2 smd: 1(0,0)
TQFN-16_L3.0-W3.0-P0.50-BL-EP1.5
  rect 0.25x0.6 smd: 1(-0.749,-1.5) 2(-0.248,-1.5) 3(0.252,-1.5) 4(0.751,-1.5) 9(0.75,1.5) 10(0.25,1.5) 11(-0.25,1.5) 12(-0.749,1.5)
  rect 0.6x0.25 smd: 5(1.5,-0.748) 6(1.5,-0.248) 7(1.5,0.252) 8(1.5,0.752) 13(-1.5,0.752) 14(-1.5,0.252) 15(-1.5,-0.248) 16(-1.5,-0.748)
  rect 1.5x1.5 smd: 17(0,0)
USB-C-SMD_TYPE-C-6PIN-2MD-073
  rect 0.55x1.1 smd: 1(-3.2,2.375) 2(-2.4,2.375) 11(2.4,2.375) 12(3.2,2.375)
  rect 0.3x1.1 smd: 3(-1.75,2.375) 4(-1.25,2.375) 5(-0.75,2.375) 6(-0.25,2.375) 7(0.25,2.375) 8(0.75,2.375) 9(1.25,2.375) 10(1.75,2.375)
  oval 1.1x2 hole 0.6x1.5: 13(-4.325,1.825) 14(4.325,1.825)
  oval 1.2x1.8 hole 0.6x1.2: 13(-4.325,-2.375) 14(4.325,-2.375)
WSON-8_L6.0-W5.0-P1.27-BL-EP
  oval 0.581x1.276 smd: 1(-1.905,-3.013) 2(-0.635,-3.013) 3(0.635,-3.013) 4(1.905,-3.013) 5(1.905,3.013) 6(0.635,3.013) 7(-0.635,3.013) 8(-1.905,3.013)
  rect 4.3x3.4 smd: 9(0,0)

## Nets
As in the schematic.

Pads without a net: U1 28 38 39 40 41 42; U3 1; U8 5; U10 5 6 12 13; U11 2; USB1 3 9; WS 1

## Via types
v1: diameter 0.5, hole 0.3, Top Layer to Bottom Layer, 110 vias

## Routing (per net, layer and track width the routed paths; a pad name or vN(x,y) marks a point on that pad's centre or on a via; arc(x,y) is an arc through that point)
GND: length 26.5
  Top Layer w0.18: 15.18,30.89 X1.2 ; v1(11.29,33.19) 12.66,33.19 12.83,33.02 12.83,32.43 X1.4
  Top Layer w0.2: v1(12.83,27.55) 12.57,27.81 10.79,27.81 9.78,28.82 9.78,32.24 10.03,32.49 11.15,32.49 11.29,32.63 v1(11.29,33.19) 11.29,34.4 11.81,34.92 v1(12.55,34.92) v1(13.84,34.92) 16.64,34.92 16.89,34.67 v1(16.89,32.41) v1(16.89,30.89) 16.8,30.89 15.62,29.71 14.6,29.71 14.35,29.46 v1(14.35,28.95)
  vias: v1(2.41,33.9) v1(2.54,34.67) v1(2.92,31.87) v1(2.92,30.22) v1(3.3,33.78) v1(3.43,27.81) v1(3.56,34.67) v1(4.19,35.3) v1(4.19,27.43) v1(4.57,33.65) v1(4.7,39.32) v1(4.7,35.94) v1(4.83,38.48) v1(4.92,35.26) v1(4.95,37.59) v1(4.95,36.61) v1(4.95,30.35) v1(5.08,34.16) v1(5.08,29.33) v1(5.21,33.14) v1(5.21,31.62) v1(5.72,35.56) v1(6.1,34.16) v1(6.35,28.44) v1(6.35,27.31) v1(6.86,35.68) v1(6.98,34.16) v1(7.62,35.56) v1(7.75,34.16) v1(8.38,28.44) v1(8.38,27.05) v1(8.51,34.79) v1(8.64,34.16) v1(8.95,26.29) v1(9.14,35.43) v1(9.52,34.79) v1(9.78,35.56) v1(9.91,34.16) v1(10.03,26.54) v1(10.29,34.92) v1(10.79,35.56) v1(10.92,34.79) v1(11.94,35.56) v1(12.95,35.56) v1(13.84,35.56) v1(14.6,35.56) v1(15.37,35.56) v1(15.62,38.6) v1(15.62,37.59) v1(15.62,36.57) v1(15.88,39.37) v1(15.88,35.94) v1(16.13,38.1) v1(16.13,37.08) v1(16.51,38.98) v1(16.51,36.44) v1(16.51,35.68) v1(16.76,38.35) v1(16.76,37.33)
VBAT: length 64.1
  Top Layer w0.8: U9.2 15.62,9.14 16.44,8.32 C27.1 C28.1 16.44,3.87 16,3.42 12.33,3.42 U13.1 7.12,3.41 6.73,3.81 6.73,8.18 R33.1 R34.2
  PWR w0.8: U13.1 18.15,3.41 18.67,3.93 18.67,24.44 19.43,25.21 27.12,25.21 v1(28.07,26.16)
  Bottom Layer w0.254: U12.3 U12.2
  Bottom Layer w0.4: v1(28.07,26.16) C54.2 27.15,27.14 27.13,27.16 26.78,27.16 U12.3
VBUS: length 50.6
  Top Layer w0.254: USB1.2 24.58,5.6 24.72,5.74 25.3,5.74 25.65,6.09 ; 25.59,9.96 25.3,10.26 24.72,10.26 24.58,10.4 USB1.11
  Top Layer w1: v1(3.05,10.79) 3.49,11.24 C29.2 C24.1 5.35,13.84 U8.1 ; 25.65,6.09 26.15,6.59 v1(26.15,7.61) 26.15,9.41 25.59,9.96
  PWR w1: v1(3.05,10.79) 4.95,10.79 5.84,9.9 5.84,2.92 7.7,1.06 24.94,1.06 26.15,2.27 v1(26.15,7.61)
VDD33: length 162.4
  Top Layer w0.18: U1.46 16.89,26.67 18.03,27.81 18.25,27.81 18.25,28.28 v1(18.41,28.44)
  Top Layer w0.254: U1.3 U1.2 12.07,24.82 8.38,24.82 8.13,24.57 8.13,23.36 7.87,23.1 C6.2 ; v1(12.32,17.78) 12.74,17.78 C7.2 13.08,17.9 13.76,18.58 14.71,18.58 14.87,18.75 14.87,18.85 14.89,18.87 U1.20 ; 8.55,29.42 11.96,26.01 U1.56 U1.55 ; R25.2 v1(23.88,34.41) ; 15.75,16.58 v1(15.75,15.74) ; v1(8.64,33.27) 8.64,32.44 C52.2 ; 28.57,30.52 v1(28.57,29.46)
  Top Layer w0.5: 5.33,18.54 4.95,18.92 4.95,21.2 5.46,21.71 6.54,21.71 ; 5.33,18.54 v1(5.33,16.89) ; 5.33,18.54 5.72,18.92 6.54,18.92 ; v1(8.25,26.28) 8.13,26.16 C30.2 ; 14.48,16.58 15.75,16.58
  Top Layer w0.8: C6.2 C34.2 7.29,26.04 C30.2 ; C51.2 28.32,30.78 C50.2 26.76,30.84 U11.8 ; C52.2 8.57,30.88 C36.2 C10.2
  PWR w0.5: 11.65,29.17 11.21,29.17 10.03,30.35 10.03,32.63 9.4,33.27 v1(8.64,33.27) ; 11.65,29.17 v1(13.33,29.17) 13.88,29.71 17.91,29.71 18.41,29.21 ; 11.65,29.17 11.18,28.7 11.18,25.78 10.67,25.27 8.64,25.27 8.25,25.65 v1(8.25,26.28) 5.84,26.28 5.33,25.78 v1(5.33,16.89) 6.6,16.89 7.24,17.52 7.24,19.05 7.85,19.65 11.71,19.65 12.32,19.05 v1(12.32,17.78) 12.32,16 12.57,15.74 v1(15.75,15.74) ; 18.41,29.21 18.41,31.8 17.27,32.95 v1(17.27,35.3) 23.49,35.3 23.88,34.92 v1(23.88,34.41) 28.19,34.41 28.57,34.03 v1(28.57,29.46) ; 18.41,29.21 v1(18.41,28.44)
  Bottom Layer w0.254: v1(17.27,35.3) 17.07,35.1 16.18,35.1 16,34.92 16,34.33 C49.2 ; FPC2.3 FPC2.4 12.19,26.6 12.19,27.94 12.45,28.19 C16.2 v1(13.33,29.17) ; v1(18.41,28.44) 18.74,28.12 FPC2.17 ; v1(1.91,10.79) 2.21,11.1 R39.2
  Bottom Layer w0.4: C49.2 17.51,34.32 U10.7 U10.8
  Bottom Layer w0.5: R7.2 4.83,19.43 5.33,18.92 v1(5.33,16.89) 5.33,10.54 4.57,9.77 2.54,9.77 1.91,10.41 v1(1.91,10.79) ; C23.2 C16.2 ; v1(18.41,28.44) 17.91,28.95 17.91,30.17 R22.2
  Bottom Layer w0.7: L1.2 16,13.46 15.83,13.62 R37.1
  Bottom Layer w0.8: R37.1 14.74,16.5 14.35,16.89 12.01,16.89 C56.2 11.84,16.82 C57.2 C58.1 C59.1 5.4,16.82 v1(5.33,16.89)
VDD_SPI: length 11.7
  Top Layer w0.18: v1(24.26,21.84) 24.89,21.2 U2.8
  Top Layer w0.254: 18.92,19.55 18.92,19.98 U1.29
  Top Layer w0.5: 18.92,19.55 C2.2 C35.2 v1(20.19,18.79)
  PWR w0.5: v1(20.19,18.79) 22.73,18.79 23.37,19.43 23.37,21.2 24,21.84 v1(24.26,21.84)
EN: length 19.5
  Top Layer w0.18: R6.1 8,21.71 8.64,22.35 8.64,22.75 9.89,24 12.08,24 U1.4 ; R6.1 7.41,22.05 7.24,22.22 4.7,22.22 4.32,22.6 4.32,26.16 3.81,26.67 v1(2.29,26.67) ; R6.1 7.41,20.43 C31.2
  Bottom Layer w0.18: RST.1 1.27,26.69 1.29,26.67 v1(2.29,26.67)
I2C_SCL: length 26.7
  Top Layer w0.18: v1(16.33,18.03) R30.1 15.75,18.16 16.09,18.5 U1.23 16.09,20.03 v1(16.26,20.19)
  Bottom Layer w0.18: FPC2.13 16.76,26.53 16.76,25.01 17.14,24.63 17.14,20.57 16.76,20.19 v1(16.26,20.19) ; U12.7 24.88,27.68 24.31,27.68 24.13,27.5 24.13,27.05 22.73,25.65 22.73,23.11 21.46,21.84 19.81,21.84 19.56,21.59 19.56,19.17 18.41,18.03 v1(16.33,18.03)
I2C_SDA: length 32.3
  Top Layer w0.18: v1(15.37,19.93) 15.69,19.61 U1.22 15.69,18.61 15.11,18.03 14.66,18.03 14.48,17.85 ; R29.1 14.48,17.85 ; 14.48,17.85 14.15,17.85 v1(13.96,18.03)
  Bottom Layer w0.18: v1(15.37,19.93) 15.6,19.7 17.29,19.7 17.65,20.06 17.65,24.89 17.24,25.3 FPC2.14 ; U12.8 24.87,28.19 23.8,28.19 23.62,28.01 23.62,27.17 21.97,25.52 21.29,25.52 21.29,25.52 20.88,25.52 20.87,25.52 19.18,25.52 18.8,25.14 18.8,19.17 18.39,18.76 14.69,18.76 v1(13.96,18.03)
I2S_SPK_BCLK: length 13.2
  Top Layer w0.18: U1.45 17.29,26.56 17.85,27.12 21.43,27.12 v1(21.48,27.17)
  Bottom Layer w0.18: U10.16 21.22,33.26 21.48,33 21.48,29.41 arc(21.42,29.27) 21.28,29.21 20.8,29.21 arc(20.6,29.01) 20.8,28.81 21.28,28.81 arc(21.42,28.75) 21.48,28.61 v1(21.48,27.17)
I2S_SPK_DOUT: length 13.5
  Top Layer w0.18: U1.44 17.69,26.45 18.04,26.79 20.07,26.79 v1(20.36,26.5)
  Bottom Layer w0.18: 19.82,32.51 20.15,32.51 20.32,32.34 20.32,28.46 arc(20.26,28.32) 20.12,28.26 19.76,28.26 arc(19.56,28.06) 19.76,27.86 20.88,27.86 arc(21.08,27.66) 20.88,27.46 19.83,27.46 arc(19.63,27.26) 19.83,27.06 20.12,27.06 arc(20.26,27) 20.32,26.86 20.32,26.54 v1(20.36,26.5)
I2S_SPK_LRCK: length 13.7
  Top Layer w0.18: v1(21.08,26.01) U1.43
  Bottom Layer w0.18: v1(21.08,26.01) 21.82,26.01 22.48,26.67 22.48,33.52 21.72,34.29 20.6,34.29 U10.14
IO0: length 14
  Top Layer w0.18: v1(8.95,21.97) 8.95,22.66 9.89,23.6 U1.5
  Bottom Layer w0.18: 1.32,20.95 3.3,20.95 3.84,21.49 IO0.1 3.85,21.59 8.57,21.59 v1(8.95,21.97) ; 1.32,20.95 1.34,20.93 R7.1 ; 1.32,20.95 BOOT.1
IO3: length 7.2
  Top Layer w0.18: U1.8 10.09,22.4 8.64,20.95 8.64,19.17 8.38,18.92 R32.1
IO10_BTN: length 17.7
  Top Layer w0.18: v1(4.57,15.24) 4.83,15.49 7.87,15.49 8.25,15.87 8.25,18.16 9.29,19.19 U1.15
  Bottom Layer w0.18: 1.32,13.58 4.32,13.58 4.57,13.84 v1(4.57,15.24) ; 1.32,13.58 1.34,13.56 R39.1 ; 1.32,13.58 IO10.1
IO19_USB_D-: length 19.7
  Top Layer w0.158: USB1.5 23.36,7.25 23.11,7.49 23.11,8 23.36,8.25 ; U1.25 16.89,18.7 16.91,18.68 16.91,18.53 16.91,18.52 16.91,8.99 17.58,8.32 21.2,8.32 arc(21.34,8.26) 21.4,8.12 arc(21.46,7.97) 21.6,7.92 21.7,7.92 arc(21.84,7.97) 21.9,8.12 arc(21.96,8.26) 22.1,8.32 23.14,8.32 23.21,8.25 23.36,8.25 ; 23.36,8.25 USB1.7
IO20_USB_D+: length 19.6
  Top Layer w0.158: U1.26 17.29,18.7 17.27,18.68 17.27,18.38 17.27,18.37 17.27,9.14 17.73,8.68 23.14,8.68 23.21,8.75 USB1.8 24.66,8.75 24.89,8.52 24.89,8 24.64,7.75 USB1.6
IO47_PM_INT: length 9.1
  Top Layer w0.18: U1.37 19.52,23.2 20.45,24.12 v1(25.02,24.12)
  Bottom Layer w0.18: U12.5 25.02,26.54 R35.1 v1(25.02,24.12)
LCD_BLK: length 4.1
  Bottom Layer w0.18: R19.2 9.52,28.19 9.78,27.94 10.92,27.94 11.24,27.62 FPC2.2
LCD_BLK_IO: length 9.5
  Top Layer w0.18: U1.7 10.77,22.8 v1(10.64,22.93)
  Bottom Layer w0.18: v1(10.64,22.93) 10.64,25.16 10.34,25.47 7.8,25.47 7.37,25.9 R20.2 7.37,28.02 Q7.1
MIC_SCK: length 14
  Top Layer w0.18: U11.6 23.11,30.83 23.11,29.94 arc(23.06,29.8) 22.91,29.74 22.68,29.74 arc(22.48,29.54) 22.68,29.34 22.91,29.34 arc(23.06,29.28) 23.11,29.14 23.11,28.7 22.73,28.32 22.05,28.32 arc(21.9,28.37) 21.85,28.52 21.85,28.75 arc(21.65,28.95) 21.45,28.75 21.45,28.52 arc(21.39,28.37) 21.25,28.32 20.85,28.32 19.86,29.3 17.6,29.3 17.24,28.95 17.24,28.16 16.08,26.99 16.08,26.03 U1.48
MIC_SD: length 14.2
  Top Layer w0.18: U1.47 16.49,26.9 17.53,27.94 17.53,28.57 17.91,28.95 19.81,28.95 20.95,27.81 22.38,27.81 arc(22.52,27.75) 22.58,27.61 22.58,27.37 arc(22.78,27.17) 22.98,27.37 22.98,27.61 arc(23.04,27.75) 23.18,27.81 24,27.81 24.26,28.06 24.26,28.93 R27.1 24.19,30.75 U11.7
MIC_WS: length 14
  Top Layer w0.18: U1.51 14.89,27.33 14.48,27.74 14.48,28.36 15.54,29.42 15.96,29.42 16.13,29.59 19.18,29.59 19.81,30.22 19.81,31.24 20.32,31.75 22.86,31.75 23.11,32 23.11,32.73 U11.3
RXD0: length 2.1
  Top Layer w0.18: U1.50 15.29,27.99 15.34,28.03 RXD0.1
SPI_CS_LCD: length 9.8
  Top Layer w0.18: U1.10 11.71,21.6 11.41,21.3 v1(11,21.3)
  Bottom Layer w0.18: FPC2.8 14.22,26.54 14.22,25.78 13.59,25.14 12.06,25.14 11.81,24.89 11.81,23.72 arc(11.76,23.59) 11.62,23.53 arc(11.49,23.48) 11.43,23.34 11.43,23.32 arc(11.49,23.19) 11.62,23.13 arc(11.76,23.08) 11.81,22.94 11.81,22.92 arc(11.76,22.79) 11.62,22.73 arc(11.49,22.68) 11.43,22.54 11.43,22.52 arc(11.49,22.39) 11.62,22.33 arc(11.76,22.28) 11.81,22.14 11.81,21.67 11.44,21.3 v1(11,21.3)
SPI_DC_LCD: length 9.1
  Top Layer w0.18: U1.9 11.41,22 11.25,21.84 10.62,21.84 v1(10.47,21.69)
  Bottom Layer w0.18: FPC2.7 13.72,26.54 13.72,25.7 13.54,25.52 11.56,25.52 11.14,25.1 11.14,22.56 10.47,21.89 v1(10.47,21.69)
SPI_MOSI: length 9.3
  Top Layer w0.18: v1(12.85,20.9) 12.76,20.81 12.62,20.81 12.62,20.8 U1.12
  Bottom Layer w0.18: FPC2.10 15.24,26.55 15.24,25.52 14.2,24.48 13.31,24.48 12.85,24.02 12.85,23.66 arc(12.79,23.52) 12.65,23.46 arc(12.45,23.26) 12.65,23.06 arc(12.85,22.86) 12.65,22.66 arc(12.45,22.46) 12.65,22.26 arc(12.85,22.06) 12.65,21.86 arc(12.45,21.66) 12.65,21.46 arc(12.79,21.4) 12.85,21.26 v1(12.85,20.9)
SPI_RST_LCD: length 9.1
  Top Layer w0.18: U1.13 12.92,20.4 v1(13.08,20.24)
  Bottom Layer w0.18: FPC2.11 15.75,26.54 15.75,25.4 14.55,24.2 13.66,24.2 13.34,23.88 13.34,20.42 13.16,20.24 v1(13.08,20.24)
SPI_SCK: length 9.7
  Top Layer w0.18: v1(11.04,20.65) 11.1,20.59 11.71,21.2 U1.11
  Bottom Layer w0.18: FPC2.9 14.74,25.65 13.84,24.76 12.45,24.76 12.14,24.46 12.14,21.61 11.19,20.65 v1(11.04,20.65)
SPICLK: length 15.7
  Top Layer w0.18: v1(26.8,21.91) 27.43,21.27 U2.6 ; v1(22.1,21.33) 21.83,21.6 U1.33
  Bottom Layer w0.18: v1(22.1,21.33) 22.1,21.97 22.61,22.47 22.91,22.47 arc(23.09,22.55) 23.16,22.72 23.16,23.37 arc(23.41,23.62) 23.66,23.37 23.66,22.72 arc(23.91,22.47) 24.16,22.72 24.16,23.37 arc(24.41,23.62) 24.66,23.37 24.66,22.72 arc(24.91,22.47) 25.16,22.72 25.16,23.37 arc(25.41,23.62) 25.66,23.37 25.66,22.72 arc(25.74,22.55) 25.91,22.47 26.23,22.47 v1(26.8,21.91)
SPICS0: length 15.1
  Top Layer w0.18: U2.1 24.86,15.11 22.99,15.11 22.48,15.62 22.48,16.75 arc(22.55,16.93) 22.73,17 23.09,17 arc(23.34,17.25) 23.09,17.5 22.73,17.5 arc(22.48,17.75) 22.73,18 23.09,18 arc(23.34,18.25) 23.09,18.5 22.73,18.5 arc(22.48,18.75) 22.73,19 23.09,19 arc(23.34,19.25) 23.09,19.5 22.73,19.5 arc(22.55,19.58) 22.48,19.75 22.48,20.25 21.53,21.2 U1.32
SPID: length 15.3
  Top Layer w0.18: U2.5 28.7,22.09 28.39,22.4 23.81,22.4 arc(23.64,22.47) 23.56,22.65 23.56,23.11 arc(23.31,23.36) 23.06,23.11 23.06,22.65 arc(22.81,22.4) 22.56,22.65 22.56,23.11 arc(22.31,23.36) 22.06,23.11 22.06,22.65 arc(21.81,22.4) 21.56,22.65 21.56,23.11 arc(21.31,23.36) 21.06,23.11 21.06,22.65 arc(20.99,22.47) 20.81,22.4 U1.35
SPIHD: length 15
  Top Layer w0.18: U1.30 20.86,20.4 v1(20.95,20.31) ; U2.7 25.82,21.17 25.53,21.46 v1(25.53,21.84)
  Bottom Layer w0.18: v1(20.95,20.31) 21.51,20.31 arc(21.68,20.24) 21.76,20.06 21.76,19.14 arc(22.01,18.89) 22.26,19.14 22.26,20.59 arc(22.51,20.84) 22.76,20.59 22.76,19.14 arc(23.01,18.89) 23.26,19.14 23.26,20.06 arc(23.33,20.24) 23.51,20.31 25.14,20.31 25.53,20.7 v1(25.53,21.84)
SPIQ: length 15.6
  Top Layer w0.18: U2.2 26,15.14 25.12,16.02 24.28,16.02 23.75,16.56 23.75,17.64 arc(23.82,17.81) 24,17.89 24.16,17.89 arc(24.41,18.14) 24.16,18.39 24,18.39 arc(23.75,18.64) 24,18.89 24.16,18.89 arc(24.41,19.14) 24.16,19.39 24,19.39 arc(23.75,19.64) 24,19.89 24.16,19.89 arc(24.41,20.14) 24.16,20.39 24,20.39 arc(23.82,20.46) 23.75,20.64 23.75,21.46 23.21,22 U1.34
SPIWP: length 15.5
  Top Layer w0.18: U1.31 21.36,20.8 21.84,20.32 21.84,14.73 22.48,14.09 27.18,14.09 27.43,14.35 U2.3
TP_INT: length 13.4
  Top Layer w0.18: U1.18 14.09,19.68 v1(13.84,19.93)
  Bottom Layer w0.18: FPC2.16 18.24,25.34 18.41,25.16 18.41,19.43 18.03,19.05 14.22,19.05 13.84,19.43 v1(13.84,19.93)
TP_RST: length 12.3
  Top Layer w0.18: v1(14.49,20.19) U1.19
  Bottom Layer w0.18: v1(14.49,20.19) 14.49,19.54 14.7,19.33 17.55,19.33 18.03,19.81 18.03,25.14 17.74,25.44 FPC2.15
TXD0: length 3.1
  Top Layer w0.18: U1.49 15.75,26.07 15.75,27.32 16.34,27.91 16.34,28.86
VSYS: length 44.8
  Top Layer w0.7: WS.4 v1(10.02,18.16)
  Top Layer w0.8: C53.2 15.88,13.9 v1(15.88,14.73)
  Top Layer w1: C53.2 C25.1 13.65,14.09 U8.8
  PWR w1: v1(15.88,14.73) 13.46,14.73 ; 13.46,14.73 12.06,14.73 10.02,16.77 v1(10.02,18.16) ; 13.46,14.73 12.57,13.84 12.57,8.12 11.56,7.11 9.65,7.11 v1(8.25,5.71)
  Bottom Layer w0.5: U14.4 18.09,8.32 17.78,8.63 14.66,8.63 R36.2
  Bottom Layer w1: U14.4 18.1,7.45 C60.2 18.1,4.38 17.91,4.19 14.22,4.19 12.7,5.71 v1(8.25,5.71)
WS2812: length 3.5
  Top Layer w0.18: WS.3 11.32,18.04 11.74,18.46 13.06,18.46 13.24,18.64 13.24,19.14 U1.16
XTAL_N: length 10.8
  Top Layer w0.18: X1.3 14.86,32.4 14.86,34.07 14.82,34.03 14.1,34.03 13.86,33.79 13.86,28.07 14.04,27.89 14.04,26.07 U1.53
XTAL_P: length 9.7
  Top Layer w0.18: X1.1 12.66,30.57 C3.2 10.41,28.7 10.92,28.19 13.33,28.19 13.69,27.83 U1.54
$1N2478: length 11.7
  Top Layer w0.18: R2.2 3.99,30.46 arc(3.99,30.47) R1.2
  Top Layer w0.2: U1.1 11.12,25.2 arc(9.9,25.7) 9.4,26.92 arc(9.14,27.55) 8.51,27.81 5.26,27.81 arc(4.36,28.18) R2.2
$1N2479: length 10.5
  Top Layer w0.18: R1.1 4,32.75 arc(4,32.76) R3.2 3.99,33.58 arc(4.35,34.44) 5.21,34.79 7.11,34.79 arc(8.1,35.2) 8.51,36.19 8.51,38.28 arc(8.53,38.33) U3.2
$1N2649: length 2.1
  Top Layer w0.18: 21.84,6.78 21.88,6.75 USB1.4
$1N2650: length 2.1
  Top Layer w0.18: R23.2 21.87,9.75 USB1.10
$1N4983: length 6
  Top Layer w0.254: 5.6,12.82 4.83,12.82 4.57,12.57 4.57,9.01 4.32,8.76 3.64,8.76 PWR.2
$1N4984: length 1.8
  Top Layer w0.254: 1.65,6.93 3.42,6.93 PWR.1
$1N4986: length 3.4
  Top Layer w0.254: U8.3 U8.4 5.79,10.09 R33.2
$1N4992: length 5
  Top Layer w0.7: U9.1 13.08,9.15 13.08,10.66 12.7,11.04 12.7,12.57 12.45,12.82 11.42,12.82
$1N4995: length 10
  Top Layer w0.4: U8.6 10.41,11.55 10.29,11.43 10.29,9.65 10.79,9.14 10.79,8.33 R34.1 10.72,6.67 11.05,6.35 14.29,6.35 C26.2
$1N6386: length 2
  Bottom Layer w0.254: R36.1 14.6,9.77 14.89,10.06 U14.1
$1N6489: length 6.4
  Bottom Layer w0.5: U14.3 20.98,10.06 21.36,10.43 L1.1
$1N8678: length 9.1
  Bottom Layer w0.4: R38.1 13.46,7.87 13.87,7.46 U14.5
  Bottom Layer w0.5: R38.1 R37.2
$2N1480: length 3.2
  Bottom Layer w0.18: 6.35,30.07 9.45,30.07 9.52,30.15
$2N1482: length 3.9
  Top Layer w0.18: v1(17.78,37.21) 19.71,37.21 SP.1
  Bottom Layer w0.18: U10.9 18.32,36.03 17.78,36.57 v1(17.78,37.21)
$2N1483: length 4.8
  Top Layer w0.18: SN.1 22.58,37.08 v1(21.34,37.08)
  Bottom Layer w0.18: v1(21.34,37.08) 20.45,36.19 18.92,36.19 18.82,36.09 U10.10
$2N1487: length 1.6
  Bottom Layer w0.18: R22.1 17.9,31.49 18.32,31.9 U10.4
$2N1489: length 1.5
  Bottom Layer w0.18: U10.2 19.32,31.05 R21.1
$2N1510: length 1.7
  Top Layer w0.18: U11.4 22.17,32.8 R25.1
$2N1512: length 1.5
  Top Layer w0.18: R26.2 22,30.73 U11.5
